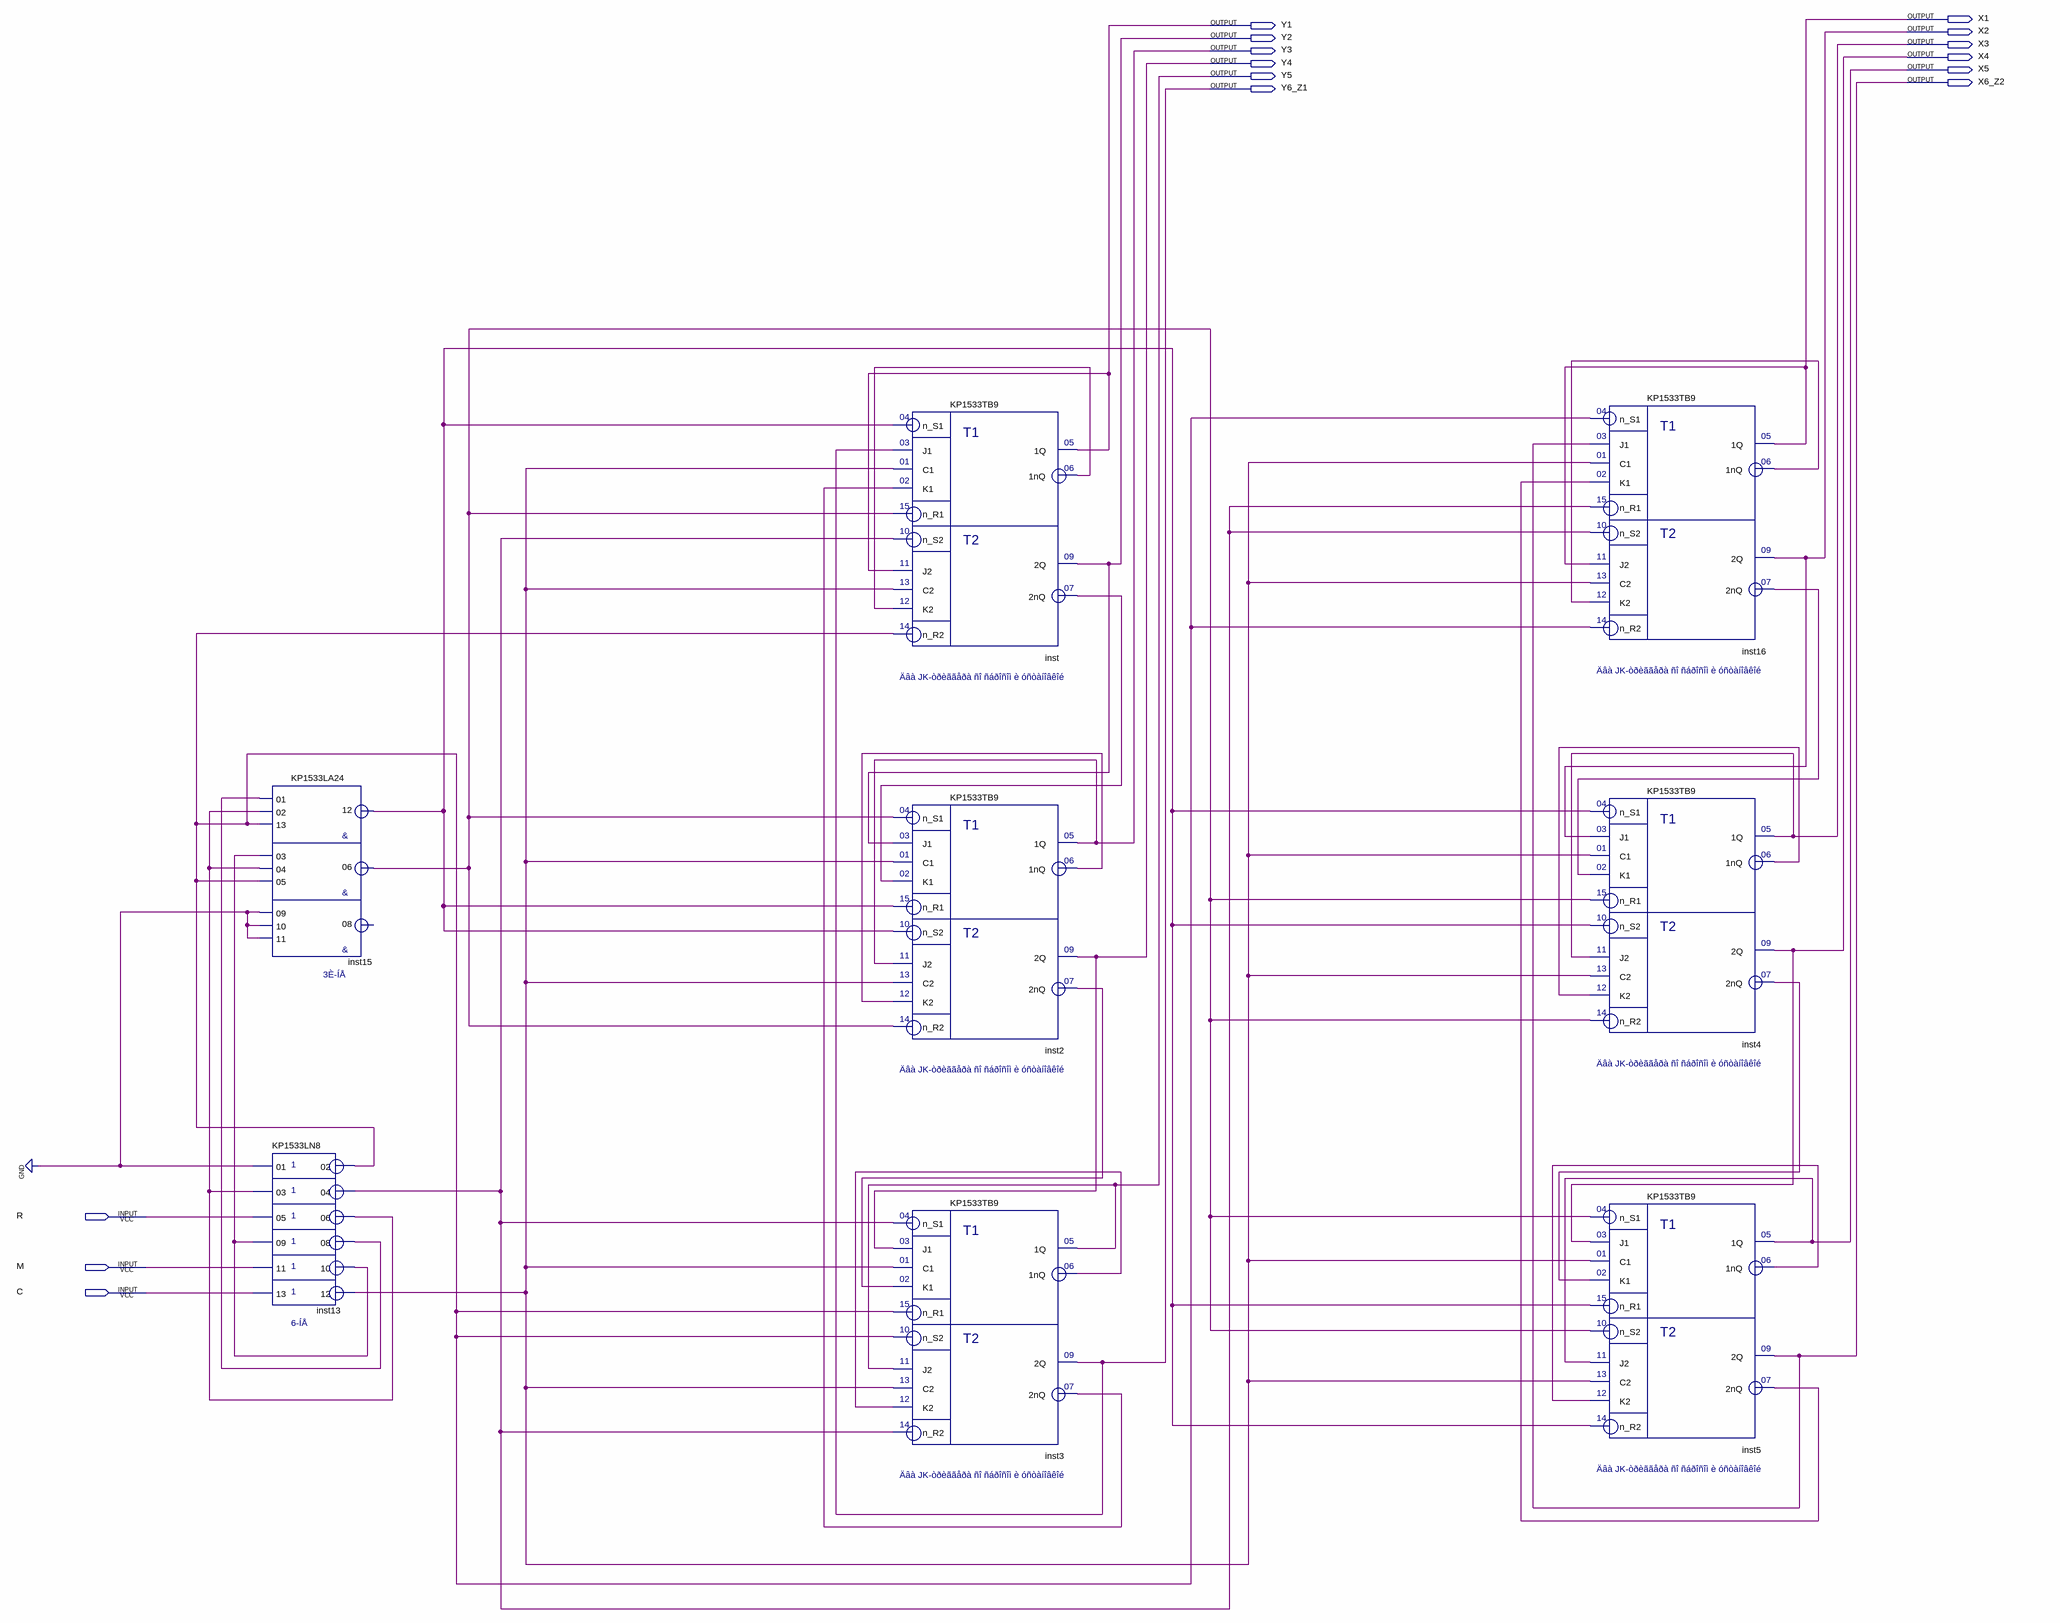
[diagram p0: schematic sheet]
// Quartus schematic KYRS_sxem.bdf as structural Verilog: 8 symbols, 15 pins
module KYRS_sxem (
  input  R,
  input  M,
  input  C,
  output X1,
  output Y1,
  output X2,
  output Y2,
  output X3,
  output Y3,
  output X4,
  output Y4,
  output X5,
  output Y5,
  output X6_Z2,
  output Y6_Z1
);

  wire inst2_1nq, inst2_2nq, inst3_1nq, inst3_2nq, inst4_1nq, inst4_2nq, inst5_1nq, inst5_2nq, inst13_02,
       inst13_04, inst13_06, inst13_08, inst13_10, inst13_12, inst15_06, inst15_12, inst16_1nq, inst16_2nq,
       inst_1nq, inst_2nq;

  KP1533LA24 inst15 (
    .\01 (inst13_08), .\02 (inst13_06), .\13 (inst13_02), .\03 (inst13_10), .\04 (inst13_06),
    .\05 (inst13_02), .\09 (1'b0), .\10 (1'b0), .\11 (1'b0), .\12 (inst15_12), .\06 (inst15_06));  // open: 08
  KP1533LN8 inst13 (
    .\01 (1'b0), .\03 (inst13_06), .\05 (R), .\09 (inst13_10), .\11 (M), .\13 (C), .\02 (inst13_02),
    .\04 (inst13_04), .\06 (inst13_06), .\08 (inst13_08), .\10 (inst13_10), .\12 (inst13_12));
  KP1533TB9 inst (
    .n_S1(inst15_12), .J1(Y6_Z1), .n_R1(inst15_06), .C1(inst13_12), .K1(inst3_2nq), .n_S2(inst13_04),
    .J2(Y1), .n_R2(inst13_02), .C2(inst13_12), .K2(inst_1nq), .\1Q (Y1), .\1nQ (inst_1nq), .\2Q (Y2),
    .\2nQ (inst_2nq));
  KP1533TB9 inst2 (
    .n_S1(inst15_06), .J1(Y2), .n_R1(inst15_12), .C1(inst13_12), .K1(inst_2nq), .n_S2(inst15_12), .J2(Y3),
    .n_R2(inst15_06), .C2(inst13_12), .K2(inst2_1nq), .\1Q (Y3), .\1nQ (inst2_1nq), .\2Q (Y4),
    .\2nQ (inst2_2nq));
  KP1533TB9 inst3 (
    .n_S1(inst13_04), .J1(Y4), .n_R1(inst13_02), .C1(inst13_12), .K1(inst2_2nq), .n_S2(inst13_02), .J2(Y5),
    .n_R2(inst13_04), .C2(inst13_12), .K2(inst3_1nq), .\1Q (Y5), .\1nQ (inst3_1nq), .\2Q (Y6_Z1),
    .\2nQ (inst3_2nq));
  KP1533TB9 inst16 (
    .n_S1(inst13_02), .J1(X6_Z2), .n_R1(inst13_04), .C1(inst13_12), .K1(inst5_2nq), .n_S2(inst13_04),
    .J2(X1), .n_R2(inst13_02), .C2(inst13_12), .K2(inst16_1nq), .\1Q (X1), .\1nQ (inst16_1nq), .\2Q (X2),
    .\2nQ (inst16_2nq));
  KP1533TB9 inst4 (
    .n_S1(inst15_12), .J1(X2), .n_R1(inst15_06), .C1(inst13_12), .K1(inst16_2nq), .n_S2(inst15_12), .J2(X3),
    .n_R2(inst15_06), .C2(inst13_12), .K2(inst4_1nq), .\1Q (X3), .\1nQ (inst4_1nq), .\2Q (X4),
    .\2nQ (inst4_2nq));
  KP1533TB9 inst5 (
    .n_S1(inst15_06), .J1(X4), .n_R1(inst15_12), .C1(inst13_12), .K1(inst4_2nq), .n_S2(inst15_06), .J2(X5),
    .n_R2(inst15_12), .C2(inst13_12), .K2(inst5_1nq), .\1Q (X5), .\1nQ (inst5_1nq), .\2Q (X6_Z2),
    .\2nQ (inst5_2nq));
endmodule
